# EAGLE design Schematic (EAGLE 9.4.2)
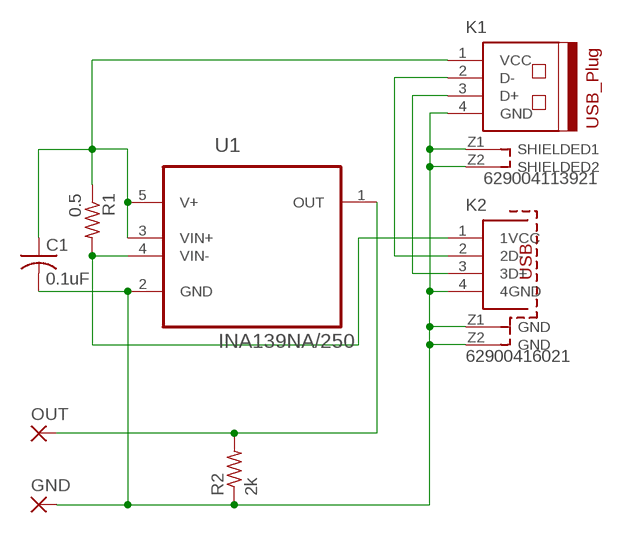
[diagram p0: schematic, sheet 1]

## Parts
C1  0.1uF  C-USC1808  [C1808]
GND  2,54/1,0  [2,54/1,0]
K1  629004113921  [629004113921]
K2  62900416021  [62900416021]
OUT  2,54/1,0  [2,54/1,0]
R1  0.5  R-US_R1206  [R1206]
R2  2k  R-US_R1206  [R1206]
U1  INA139NA/250  [SOT95P280X145-5N]

## Nets
N$1: C1.2 GND.1(P) K1.4(GND) K1.Z1(SHIELDED1) K1.Z2(SHIELDED2) K2.4(4GND) K2.Z1(GND) K2.Z2(GND) R2.1 U1.2(GND)
N$2: K1.3(D+) K2.3(3D+)
N$3: K1.2(D-) K2.2(2D-)
N$4: C1.1 K1.1(VCC) R1.1 U1.3(VIN+) U1.5(V+)
N$5: OUT.1(P) R2.2 U1.1(OUT)
N$6: K2.1(1VCC) R1.2 U1.4(VIN-)

## Library data of the parts
C1 = rcl:C-US: CAPACITOR, American symbol; SPICEPREFIX: C
GND OUT = wirepad:2,54/1,0: THROUGH-HOLE PAD
K1 = Wurth_Elektronik_Electromechanic_Input-Output_Connectors_rev15c:629004113921: WR-COM Plug SMT With Clip USB Type A,4 pins=>Code : Con_I-O_COM_USB-2.0_A_629004113921 <http://katalog.we-online.de/media/images/eican/Con_I-O_COM_USB-2.0_A_629004113921_pf2.jpg> Details see: http://katalog.we-online.de/en/em/629_004_113_921 Created 2014-07-09, Karrer Zheng 2014 (C) Würth Elektronik
K2 = Wurth_Elektronik_Electromechanic_Input-Output_Connectors_rev15c:62900416021: WR-COM SMT Horizontal USB Type A,4 pins=>Code : Con_I-O_COM_USB-2.0_A_62900416021 <http://katalog.we-online.de/media/images/eican/Con_I-O_COM_USB-2.0_A_62900416021_pf2.jpg> Details see: http://katalog.we-online.de/en/em/629_004_160_21 Created 2014-07-09, Karrer Zheng 2014 (C) Würth Elektronik
R1 R2 = rcl:R-US_: RESISTOR, American symbol; SPICEPREFIX: R
U1 = Texas Instruments_By_element14_Batch_1:INA139NA/250: High-Side Measurement CURRENT SHUNT MONITOR; MPN: INA139NA/250; OC_FARNELL: 1470398; OC_NEWARK: 39C3949; PACKAGE: SOT-23-5; SUPPLIER: Texas Instruments

## Board
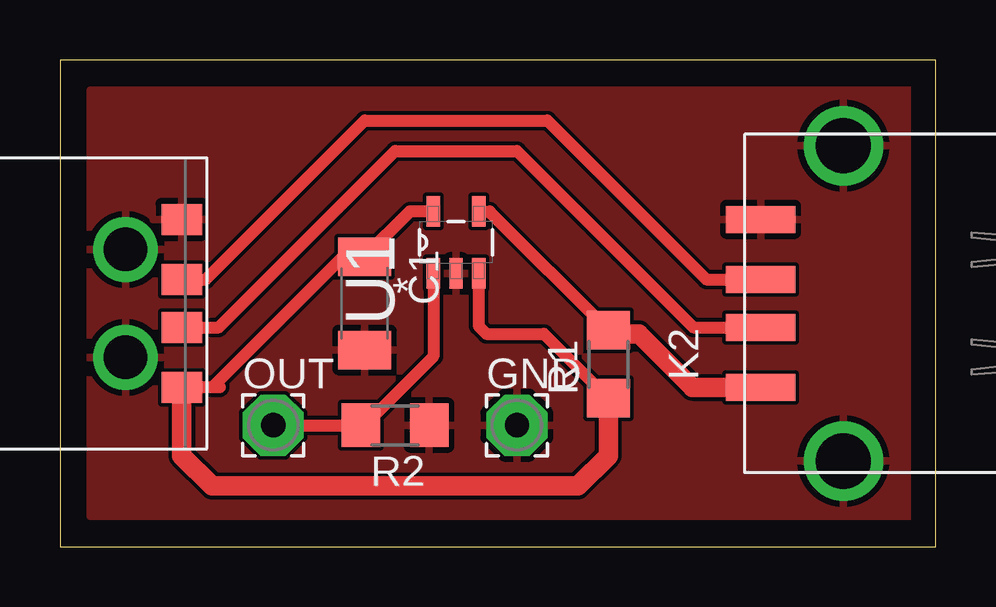
[diagram p1: board, top side]

Size 36.5 x 20.31 mm. Coordinates in mm from the lower left corner, seen from the top.
Outline: 0,0 36.5,0 36.5,20.31 0,20.31 0,0
Copper layers (1*16): Top 0.035mm / dielectric 1.5mm / Bottom 0.035mm
Design rules "default *": minimum track width 6mil, minimum drill 0.35mm, track to track 6mil, track to pad 6mil, pad to pad 6mil, via to via 6mil, smd to smd 6mil, copper to edge 40mil, drill to drill 6mil, minimum pad ring 10mil, minimum via ring 8mil, stop-mask expansion 4mil, vias tented up to drill 0mil, thermal gap 10mil

### Footprints (pad centres in the part's own frame; a part is rotated, then mirrored left to right if it is on the bottom)
C1808 = smd 1.6 x 2.2: 1 -1.95,0; 2 1.95,0
2,54/1,0 = drill 1.016 pad 2.54 octagon: 1 0,0
629004113921 = smd 1.3 x 1.7: 1 -3.5,0; 2 -1,0; 3 1,0; 4 3.5,0 | drill 1.8: Z1 -2.25,2.35; Z2 2.25,2.35
62900416021 = smd 1.12 x 2.88: 1 -3.5,0; 2 -1,0; 3 1,0; 4 3.5,0 | drill 2.3: Z1 -6.575,-3.45; Z2 6.575,-3.45
R1206 = smd 1.6 x 1.803: 1 -1.422,0; 2 1.422,0
SOT95P280X145-5N = smd 1.27 x 0.559: 1 -1.295,0.94; 2 -1.295,0; 3 -1.295,-0.94; 4 1.295,-0.94; 5 1.295,0.94

### Placement (x,y rotation side)
C1  12.7,10.16 270 top
GND  19.05,5.08 0 top
K1  5.08,10.16 90 top
K2  29.21,10.16 90 top
OUT  8.89,5.08 0 top
R1  22.86,7.62 90 top
R2  13.97,5.08 180 top
U1  16.51,12.7 90 top

### Tracks (layer width: path | path; a pad name or v marks a point on that pad's centre or on a via)
N$1
  Top 0.305: 16.51,11.81 U1.2
  pour Top: 1.27,19.05 35.56,19.05 35.56,1.27 1.27,1.27
N$2
  Top 0.508: K1.3 6.08,11.16 12.7,17.78 20.32,17.78 26.94,11.16 K2.3
N$3
  Top 0.508: K1.2 6.62,9.16 13.97,16.51 19.05,16.51 26.4,9.16 K2.2
N$4
  Top 0.508: 22.66,6.2 R1.1 20.17,8.89 17.78,8.89 17.45,9.22 U1.3 | 6.66,6.66 6.35,6.66 | 6.35,6.66 K1.1 | U1.5 14.59,14 C1.1 11.8,12.11 6.35,6.66
  Top 0.813: 23.01,6.2 R1.1 22.86,3.81 21.59,2.54 6.35,2.54 5.08,3.81 K1.1
N$5
  Top 0.508: U1.1 15.57,7.95 12.7,5.08 R2.2 OUT.1
N$6
  Top 0.508: U1.4 17.91,14 R1.2
  Top 0.813: R1.2 23.01,8.89 24.13,8.89 26.36,6.66 K2.1